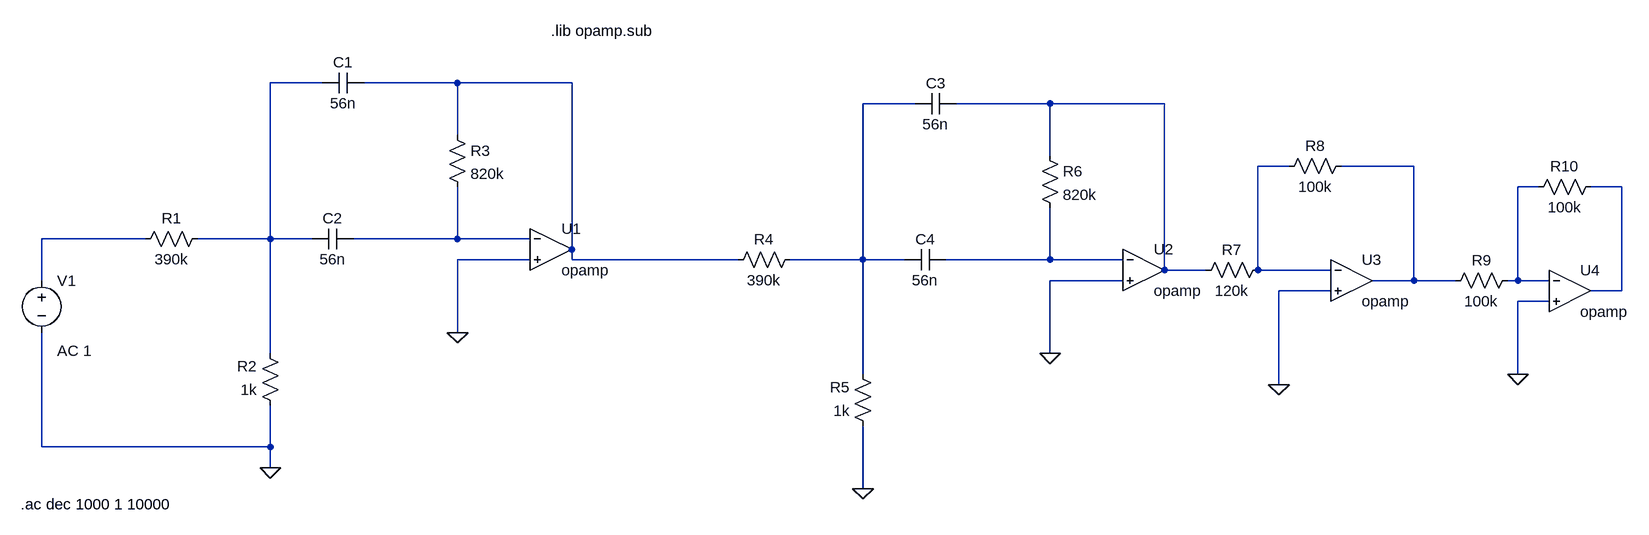
[diagram p0: schematic adc.asc]
adc.asc, the LTspice schematic file:
Version 4
SHEET 1 2324 680
WIRE 320 -224 240 -224
WIRE 528 -224 384 -224
WIRE 704 -224 528 -224
WIRE 1232 -192 1152 -192
WIRE 1440 -192 1296 -192
WIRE 1616 -192 1440 -192
WIRE 528 -144 528 -224
WIRE 1440 -112 1440 -192
WIRE 1808 -96 1760 -96
WIRE 2000 -96 1888 -96
WIRE 2192 -64 2160 -64
WIRE 2320 -64 2272 -64
WIRE 48 16 -112 16
WIRE 240 16 240 -224
WIRE 240 16 128 16
WIRE 304 16 240 16
WIRE 528 16 528 -64
WIRE 528 16 368 16
WIRE 640 16 528 16
WIRE 704 32 704 -224
WIRE 640 48 528 48
WIRE 704 48 704 32
WIRE 960 48 704 48
WIRE 1152 48 1152 -192
WIRE 1152 48 1040 48
WIRE 1216 48 1152 48
WIRE 1440 48 1440 -32
WIRE 1440 48 1280 48
WIRE 1552 48 1440 48
WIRE 1616 64 1616 -192
WIRE 1680 64 1616 64
WIRE 1760 64 1760 -96
WIRE 1872 64 1760 64
WIRE -112 80 -112 16
WIRE 1552 80 1440 80
WIRE 2000 80 2000 -96
WIRE 2000 80 1936 80
WIRE 2064 80 2000 80
WIRE 2160 80 2160 -64
WIRE 2160 80 2144 80
WIRE 2208 80 2160 80
WIRE 1872 96 1792 96
WIRE 2320 96 2320 -64
WIRE 2320 96 2272 96
WIRE 2208 112 2160 112
WIRE 528 160 528 48
WIRE 240 192 240 16
WIRE 1440 192 1440 80
WIRE 1152 224 1152 48
WIRE 2160 224 2160 112
WIRE 1792 240 1792 96
WIRE -112 336 -112 160
WIRE 240 336 240 272
WIRE 240 336 -112 336
WIRE 240 368 240 336
WIRE 1152 400 1152 304
FLAG 240 368 0
FLAG 528 160 0
FLAG 1152 400 0
FLAG 1440 192 0
FLAG 1792 240 0
FLAG 2160 224 0
SYMBOL res 144 0 R90
WINDOW 0 0 56 VBottom 2
WINDOW 3 32 56 VTop 2
SYMATTR InstName R1
SYMATTR Value 390k
SYMATTR SpiceLine tol=10
SYMBOL res 256 288 R180
WINDOW 0 36 76 Left 2
WINDOW 3 36 40 Left 2
SYMATTR InstName R2
SYMATTR Value 1k
SYMATTR SpiceLine tol=10
SYMBOL res 512 -160 R0
SYMATTR InstName R3
SYMATTR Value 820k
SYMATTR SpiceLine tol=10
SYMBOL cap 384 -240 R90
WINDOW 0 0 32 VBottom 2
WINDOW 3 32 32 VTop 2
SYMATTR InstName C1
SYMATTR Value 56n
SYMBOL cap 368 0 R90
WINDOW 0 0 32 VBottom 2
WINDOW 3 32 32 VTop 2
SYMATTR InstName C2
SYMATTR Value 56n
SYMBOL OpAmps\\opamp 672 -32 R0
SYMATTR InstName U1
SYMBOL voltage -112 64 R0
WINDOW 123 24 124 Left 2
WINDOW 39 0 0 Left 0
SYMATTR Value2 AC 1
SYMATTR InstName V1
SYMATTR Value ""
SYMBOL res 1056 32 R90
WINDOW 0 0 56 VBottom 2
WINDOW 3 32 56 VTop 2
SYMATTR InstName R4
SYMATTR Value 390k
SYMATTR SpiceLine tol=10
SYMBOL res 1168 320 R180
WINDOW 0 36 76 Left 2
WINDOW 3 36 40 Left 2
SYMATTR InstName R5
SYMATTR Value 1k
SYMATTR SpiceLine tol=10
SYMBOL res 1424 -128 R0
SYMATTR InstName R6
SYMATTR Value 820k
SYMATTR SpiceLine tol=10
SYMBOL cap 1296 -208 R90
WINDOW 0 0 32 VBottom 2
WINDOW 3 32 32 VTop 2
SYMATTR InstName C3
SYMATTR Value 56n
SYMBOL cap 1280 32 R90
WINDOW 0 0 32 VBottom 2
WINDOW 3 32 32 VTop 2
SYMATTR InstName C4
SYMATTR Value 56n
SYMBOL OpAmps\\opamp 1584 0 R0
SYMATTR InstName U2
SYMBOL OpAmps\\opamp 1904 16 R0
SYMATTR InstName U3
SYMBOL OpAmps\\opamp 2240 32 R0
SYMATTR InstName U4
SYMBOL res 1776 48 R90
WINDOW 0 0 56 VBottom 2
WINDOW 3 32 56 VTop 2
SYMATTR InstName R7
SYMATTR Value 120k
SYMATTR SpiceLine tol=10
SYMBOL res 1904 -112 R90
WINDOW 0 0 56 VBottom 2
WINDOW 3 32 56 VTop 2
SYMATTR InstName R8
SYMATTR Value 100k
SYMATTR SpiceLine tol=10
SYMBOL res 2160 64 R90
WINDOW 0 0 56 VBottom 2
WINDOW 3 32 56 VTop 2
SYMATTR InstName R9
SYMATTR Value 100k
SYMATTR SpiceLine tol=10
SYMBOL res 2288 -80 R90
WINDOW 0 0 56 VBottom 2
WINDOW 3 32 56 VTop 2
SYMATTR InstName R10
SYMATTR Value 100k
SYMATTR SpiceLine tol=10
TEXT -144 424 Left 2 !.ac dec 1000 1 10000
TEXT 672 -304 Left 2 !.lib opamp.sub

The netlist it stands for:
* adc.asc
R1 N001 N009 390k tol=10
R2 0 N001 1k tol=10
R3 N002 N010 820k tol=10
C1 N002 N001 56n
C2 N010 N001 56n
XU1 N010 0 N002 opamp Aol=100K GBW=10Meg  ; pins invin noninvin out
V1 N009 0 AC 1
R4 N003 N002 390k tol=10
R5 0 N003 1k tol=10
R6 N004 N011 820k tol=10
C3 N004 N003 56n
C4 N011 N003 56n
XU2 N011 0 N004 opamp Aol=100K GBW=10Meg  ; pins invin noninvin out
XU3 N005 0 N006 opamp Aol=100K GBW=10Meg  ; pins invin noninvin out
XU4 N007 0 N008 opamp Aol=100K GBW=10Meg  ; pins invin noninvin out
R7 N005 N004 120k tol=10
R8 N006 N005 100k tol=10
R9 N007 N006 100k tol=10
R10 N008 N007 100k tol=10
.ac dec 1000 1 10000
.lib opamp.sub
.backanno
.end